# EAGLE design LiPoCharger (EAGLE 7.1.0)
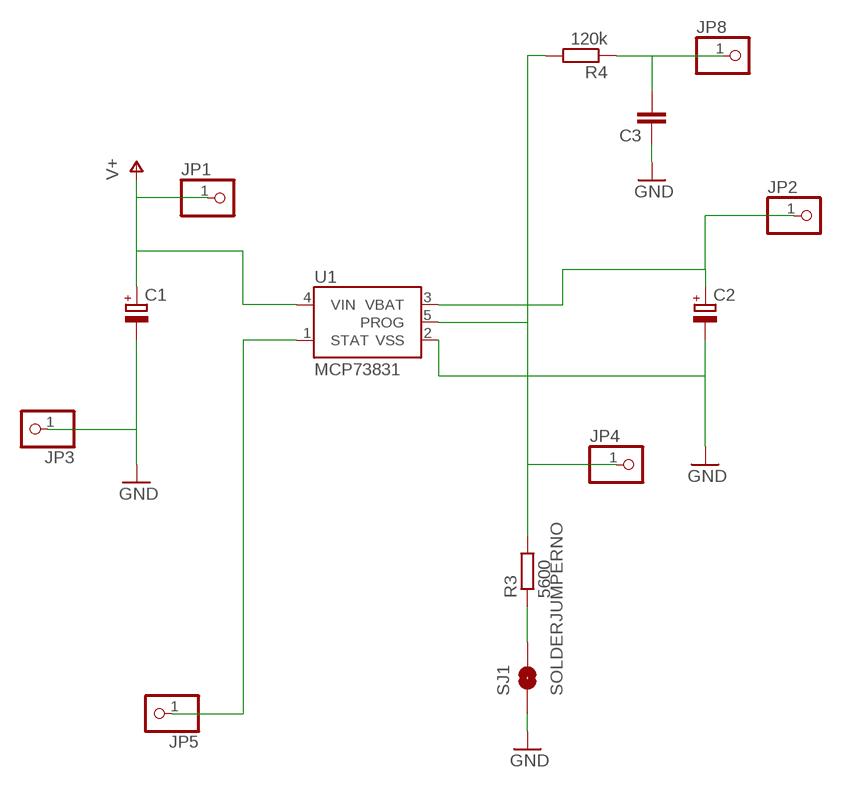
[diagram p0: schematic, sheet 1]

## Parts
C1  CPOL-EUE2.5-6  [E2,5-6]
C2  CPOL-EUE2.5-6  [E2,5-6]
C3  C-EUC1206  [C1206]
JP1  PINHD-1X1  [1X01]
JP2  PINHD-1X1  [1X01]
JP3  PINHD-1X1  [1X01]
JP4  PINHD-1X1  [1X01]
JP5  PINHD-1X1  [1X01]
JP8  PINHD-1X1  [1X01]
R3  5600  R-EU_R0402  [R0402]
R4  120k  R-EU_R0402  [R0402]
SJ1  SOLDERJUMPERNO  [SJ_2S-NO]
U1  MCP73831  [SOT23-5]

## Nets
GND: C1.- C2.- C3.1 JP3.1 SJ1.1 U1.2(VSS)
N$3: JP5.1 U1.1(STAT)
N$4: JP4.1 R3.2 R4.2 U1.5(PROG)
N$5: C3.2 JP8.1 R4.1
N$6: R3.1 SJ1.2
V+: C1.+ JP1.1 U1.4(VIN)
VBATT: C2.+ JP2.1 U1.3(VBAT)

## Library data of the parts
C1 C2 = rcl:CPOL-EU: POLARIZED CAPACITOR, European symbol
C3 = rcl:C-EU: CAPACITOR, European symbol
JP1-JP5 JP8 = pinhead:PINHD-1X1: PIN HEADER
R3 R4 = rcl:R-EU_: RESISTOR, European symbol
SJ1 = SparkFun:SOLDERJUMPER: Solder Jumper Standard SMD solder jumper. Used to automate production. Two varients : Normally Open and Normally Closed are the same, but have different paste layers. NC will have a large amount of paste and should jumper during reflow.
U1 = SparkFun:MCP73831: Microchip's MCP73831 Miniature single cell, fully integrated Li-Ion, Li-polymer charge management controller http://ww1.microchip.com/downloads/en/DeviceDoc/21984a.pdf

## Board
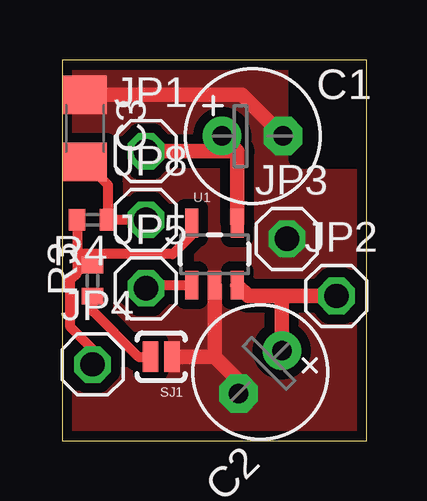
[diagram p1: board, top side]
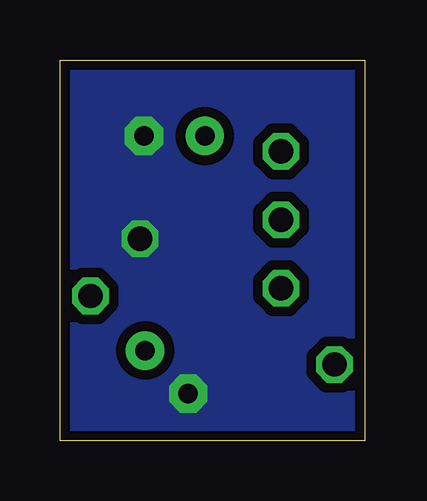
[diagram p2: board, bottom side, seen from below]

Size 12.7 x 15.88 mm. Coordinates in mm from the lower left corner, seen from the top.
Outline: 0,0 12.7,0 12.7,15.88 0,15.88 0,0
Copper layers (1*16): Top 0.035mm / dielectric 1.5mm / Bottom 0.035mm
Design rules "SeeedStudio_2layer_DRU_no_angle_20140221": minimum track width 6mil, minimum drill 12mil, track to track 6mil, track to pad 6mil, pad to pad 6mil, via to via 6mil, smd to smd 0mil, copper to edge 10mil, drill to drill 10mil, minimum pad ring 10mil, minimum via ring 6mil, stop-mask expansion 2mil, vias tented up to drill 100mil, thermal gap 10mil
tRestrict: area 9.8,11.7 to 12.1,18.1; area 12.1,15.9 to 13.3,18.1

### Footprints (pad centres in the part's own frame; a part is rotated, then mirrored left to right if it is on the bottom)
E2,5-6 = drill 0.813 pad 1.6: + -1.27,0 | drill 0.813 pad 1.6 octagon: - 1.27,0
C1206 = smd 1.6 x 1.8: 1 -1.4,0; 2 1.4,0
1X01 = drill 1.016 octagon: 1 0,0
R0402 = smd 0.7 x 0.9: 1 -0.65,0; 2 0.65,0
SJ_2S-NO = smd 0.635 x 1.27: 1 -0.45,0; 2 0.45,0
SOT23-5 = smd 0.55 x 1.2: 1 -0.95,-1.3; 2 0,-1.3; 3 0.95,-1.3; 4 0.95,1.3; 5 -0.95,1.3

### Placement (x,y rotation side)
C1  7.94,12.7 0 top
C2  8.26,2.86 225 top
C3  0.95,13.02 270 top
JP1  3.49,12.06 0 top
JP2  11.43,6.03 0 top
JP3  9.37,8.41 0 top
JP4  1.27,3.17 0 top
JP5  3.49,6.35 0 top
JP8  3.49,9.21 0 top
R3  1.27,6.67 90 top
R4  1.27,9.21 180 top
SJ1  4.13,3.49 180 top
U1  6.35,7.78 0 top

### Tracks (layer width: path | path; a pad name or v marks a point on that pad's centre or on a via)
GND
  Top 0.61: SJ1.1 6.35,3.49 | C3.1 7.49,14.42 C1.- | U1.2 6.35,3.49 | C2.- 7.36,2.49 6.35,3.49
  pour Top (isolate 0.406, no thermals): 0,0 0,15.88 12.7,15.88 12.7,0
  pour Bottom (isolate 0.406, no thermals): 0,0 0,15.88 12.7,15.88 12.7,0
N$3
  Top 0.406: U1.1 3.62,6.48 JP5.1
N$4
  Top 0.406: R4.2 0.62,7.78 | 0.62,7.78 0.62,7 0.32,6.7 0.32,4.76 1.27,3.81 JP4.1 | 1.27,7.78 4.6,7.78 5.4,8.57 U1.5 | 1.27,7.78 0.62,7.78 | R3.2 1.27,7.78
N$5
  Top 0.406: C3.2 1.92,10.65 R4.1 JP8.1
N$6
  Top 0.406: R3.1 1.27,5.4 3.17,3.49 SJ1.2
V+
  Top 0.61: U1.4 7.3,12.07 7.14,12.22 | 7.14,12.22 C1.+ | JP1.1 6.99,12.06 7.14,12.22
VBATT
  Top 0.61: JP2.1 9.21,6.03 | 9.21,6.03 7.75,6.03 U1.3 | C2.+ 9.15,5.98 9.21,6.03